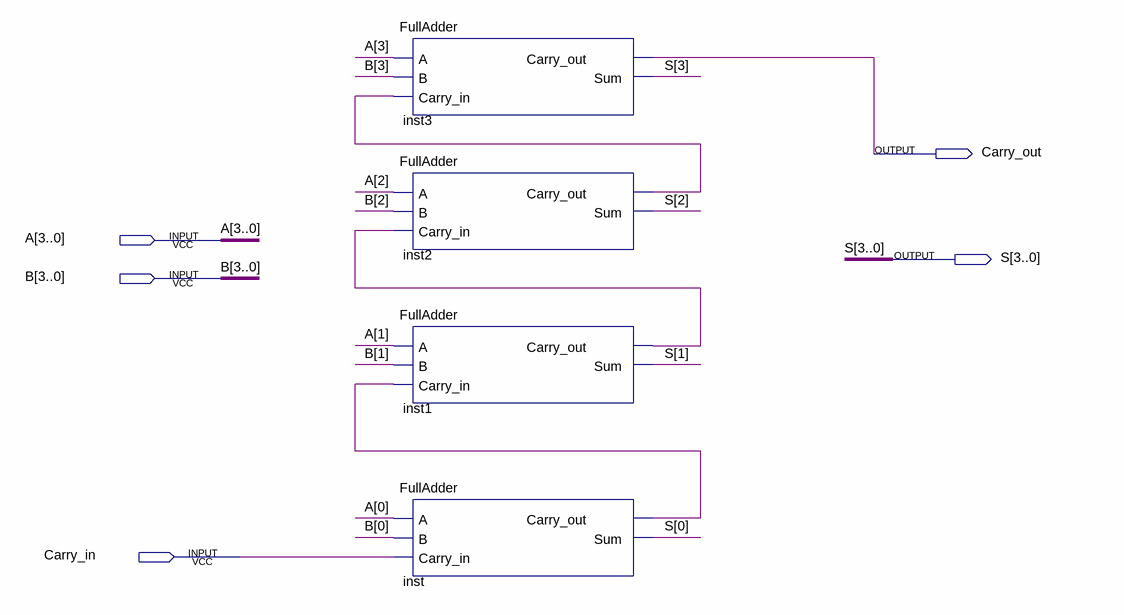
[diagram p0: schematic sheet]
// Quartus schematic fourbitadd.bdf as structural Verilog: 4 symbols, 5 pins
module fourbitadd (
  input  [3:0] A,
  input  [3:0] B,
  input  Carry_in,
  output Carry_out,
  output [3:0] S
);

  wire inst1_carry_out, inst2_carry_out, inst_carry_out;

  FullAdder inst3 (.A(A[3]), .B(B[3]), .Carry_in(inst2_carry_out), .Carry_out(Carry_out), .Sum(S[3]));
  FullAdder inst2 (.A(A[2]), .B(B[2]), .Carry_in(inst1_carry_out), .Carry_out(inst2_carry_out), .Sum(S[2]));
  FullAdder inst1 (.A(A[1]), .B(B[1]), .Carry_in(inst_carry_out), .Carry_out(inst1_carry_out), .Sum(S[1]));
  FullAdder inst (.A(A[0]), .B(B[0]), .Carry_in(Carry_in), .Carry_out(inst_carry_out), .Sum(S[0]));
endmodule
